# EAGLE schematic NEOPUUTA (EAGLE 9.6.2)
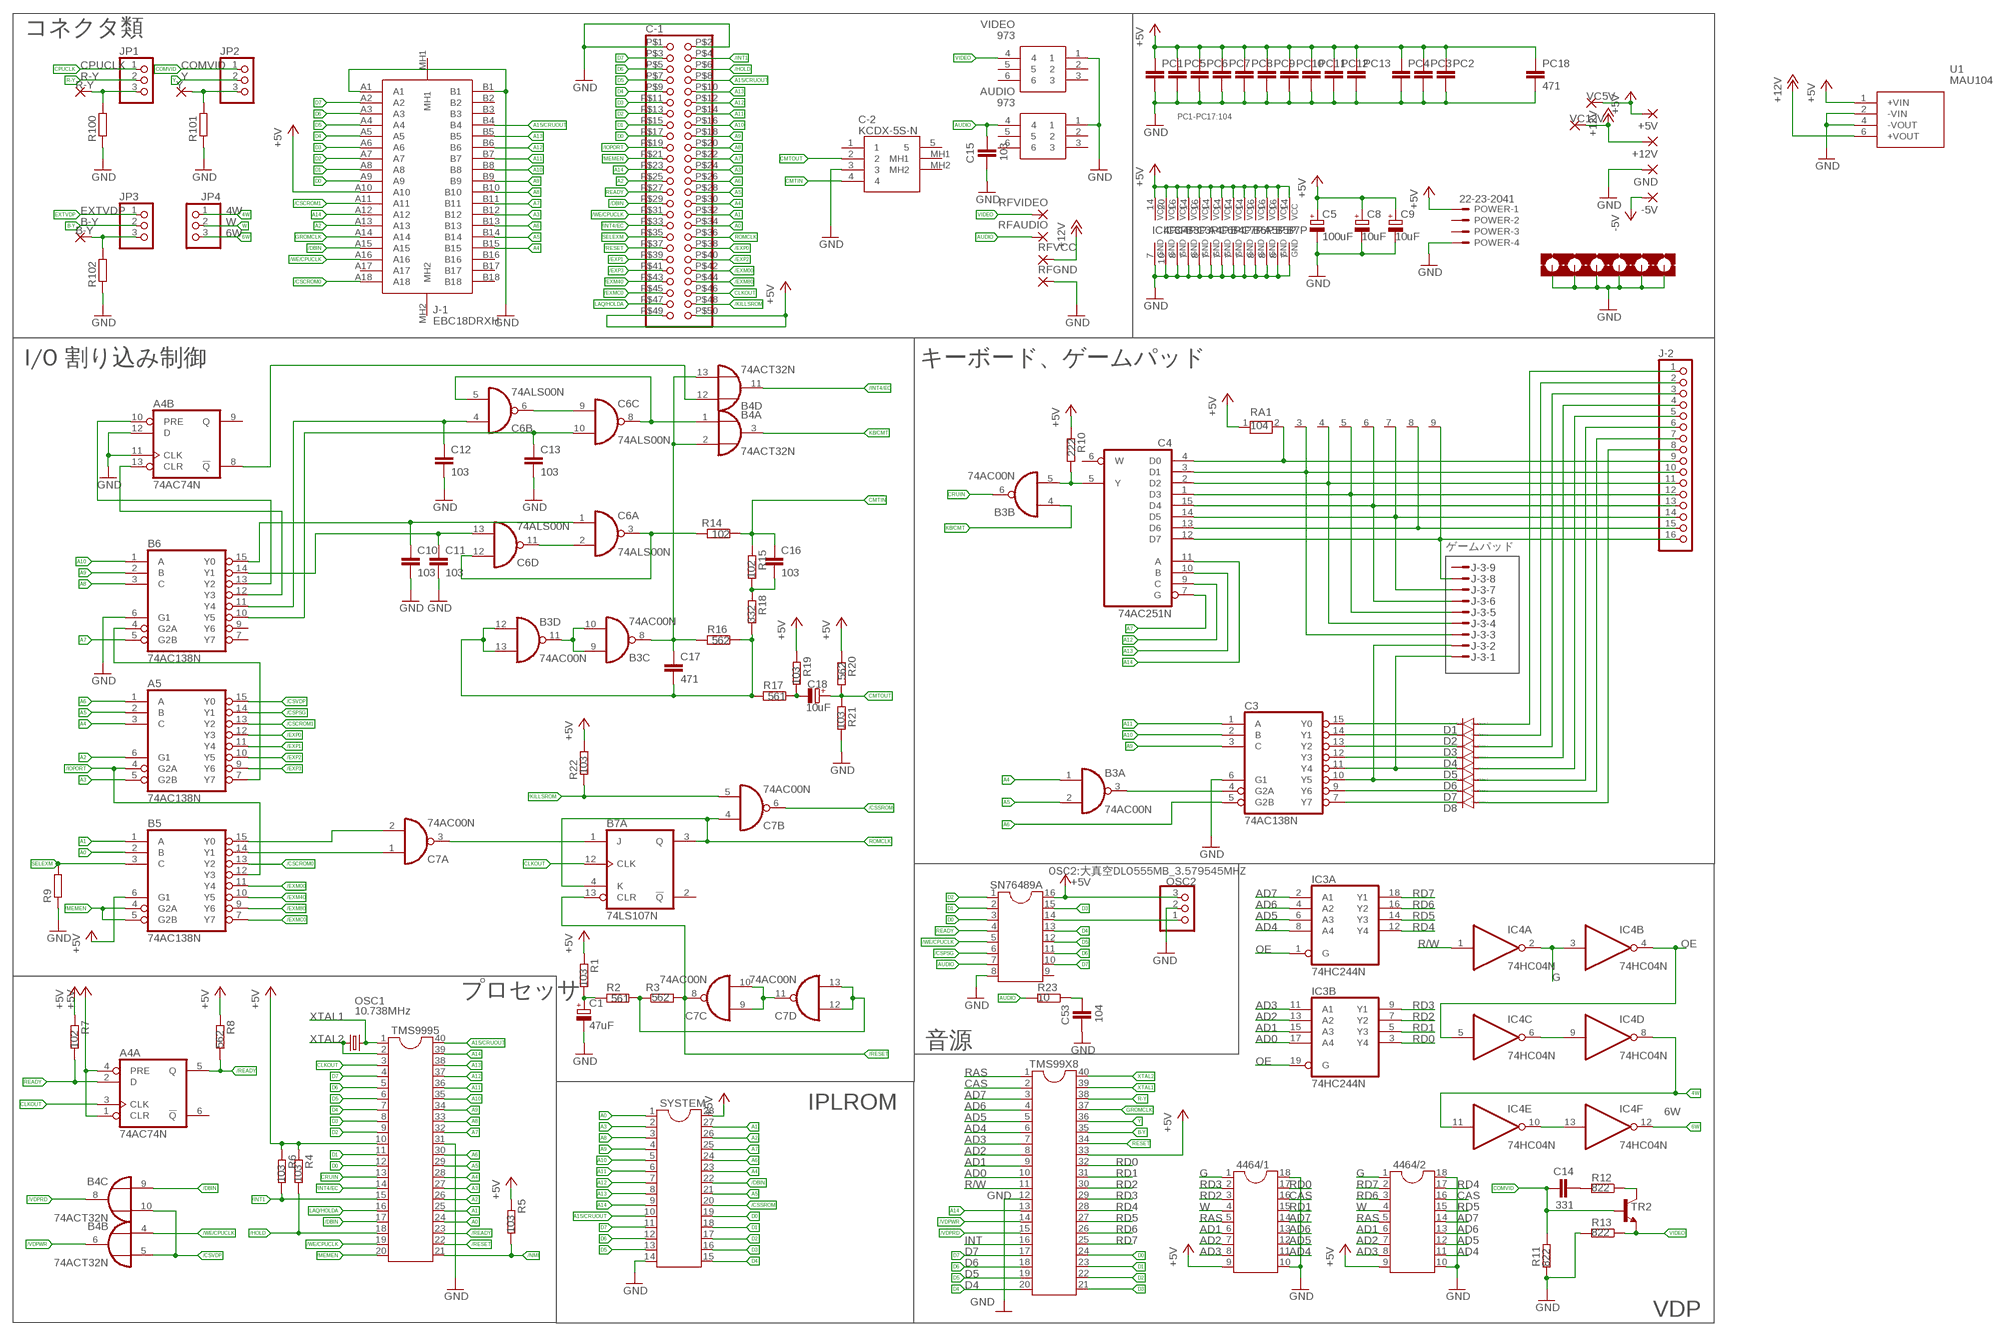
[diagram p0: schematic, sheet 1]

## Parts
4464/1  DIL18  [DIL18]
4464/2  DIL18  [DIL18]
+5V  3,81/1,4  [3,81/1,4]
+12V  3,81/1,4  [3,81/1,4]
-5V  3,81/1,4  [3,81/1,4]
A4  74AC74N  [DIL14]
A5  74AC138N  [DIL16]
AUDIO  973  [973_1]
B3  74AC00N  [DIL14]
B4  74ACT32N  [DIL14]
B5  74AC138N  [DIL16]
B6  74AC138N  [DIL16]
B7  74LS107N  [DIL14]
B-Y  1,6/0,9  [1,6/0,9]
C1  47uF  CPOL-EUE1.8-4  [E1,8-4]
C3  74AC138N  [DIL16]
C4  74AC251N  [DIL16]
C5  100uF  CPOL-EUE2.5-7  [E2,5-7]
C6  74ALS00N  [DIL14]
C7  74AC00N  [DIL14]
C8  10uF  CPOL-EUE1.8-4  [E1,8-4]
C9  10uF  CPOL-EUE1.8-4  [E1,8-4]
C10  103  C-EU050-025X075  [C050-025X075]
C11  103  C-EU050-025X075  [C050-025X075]
C12  103  C-EU050-025X075  [C050-025X075]
C13  103  C-EU050-025X075  [C050-025X075]
C14  331  C-EU050-025X075  [C050-025X075]
C15  103  C-EU050-025X075  [C050-025X075]
C16  103  C-EU050-025X075  [C050-025X075]
C17  471  C-EU050-025X075  [C050-025X075]
C18  10uF  CPOL-EUE1.8-4  [E1,8-4]
C53  104  C-EU050-025X075  [C050-025X075]
C-1  50PI_CARDEDGE_2.54MM_MOTHER  [50PIN_CARDEDGE_2.54MM]
C-2  KCDX-5S-N  [KCDX5SN]
D1  1N4148DO35-10  [DO35-10]
D2  1N4148DO35-10  [DO35-10]
D3  1N4148DO35-10  [DO35-10]
D4  1N4148DO35-10  [DO35-10]
D5  1N4148DO35-10  [DO35-10]
D6  1N4148DO35-10  [DO35-10]
D7  1N4148DO35-10  [DO35-10]
D8  1N4148DO35-10  [DO35-10]
GND  3,81/1,4  [3,81/1,4]
H1  MOUNT-PAD-SQUARE3.2  [3,2-PAD-SQUARE]
H2  MOUNT-PAD-SQUARE3.2  [3,2-PAD-SQUARE]
H3  MOUNT-PAD-SQUARE3.2  [3,2-PAD-SQUARE]
H4  MOUNT-PAD-SQUARE3.2  [3,2-PAD-SQUARE]
H5  MOUNT-PAD-SQUARE3.2  [3,2-PAD-SQUARE]
H6  MOUNT-PAD-SQUARE3.2  [3,2-PAD-SQUARE]
IC3  74HC244N  [DIL20]
IC4  74HC04N  [DIL14]
J-1  EBC18DRXH  [EBC18DRXH]
J-2  PINHD-1X16  [1X16]
J-3  M09HPS  [M09HP]
JP1  PINHD-1X3  [1X03]
JP2  PINHD-1X3  [1X03]
JP3  PINHD-1X3  [1X03]
JP4  PINHD-1X3  [1X03]
OSC1  10.738MHz  CRYSTALHC49S  [HC49/S]
OSC2  PINHD-1X3  [1X03]
PC1  C-EU050-025X075  [C050-025X075]
PC2  C-EU050-025X075  [C050-025X075]
PC3  C-EU050-025X075  [C050-025X075]
PC4  C-EU050-025X075  [C050-025X075]
PC5  C-EU050-025X075  [C050-025X075]
PC6  C-EU050-025X075  [C050-025X075]
PC7  C-EU050-025X075  [C050-025X075]
PC8  C-EU050-025X075  [C050-025X075]
PC9  C-EU050-025X075  [C050-025X075]
PC10  C-EU050-025X075  [C050-025X075]
PC11  C-EU050-025X075  [C050-025X075]
PC12  C-EU050-025X075  [C050-025X075]
PC13  C-EU050-025X075  [C050-025X075]
PC18  471  C-EU050-025X075  [C050-025X075]
POWER  22-23-2041  [22-23-2041]
R1  103  R-EU_0207/10  [0207/10]
R2  561  R-EU_0207/10  [0207/10]
R3  562  R-EU_0207/10  [0207/10]
R4  103  R-EU_0207/10  [0207/10]
R5  103  R-EU_0207/10  [0207/10]
R6  103  R-EU_0207/10  [0207/10]
R7  102  R-EU_0207/10  [0207/10]
R8  562  R-EU_0207/10  [0207/10]
R9  R-EU_0207/10  [0207/10]
R10  222  R-EU_0207/10  [0207/10]
R11  822  R-EU_0207/10  [0207/10]
R12  822  R-EU_0207/10  [0207/10]
R13  822  R-EU_0207/10  [0207/10]
R14  102  R-EU_0207/10  [0207/10]
R15  102  R-EU_0207/10  [0207/10]
R16  562  R-EU_0207/10  [0207/10]
R17  561  R-EU_0207/10  [0207/10]
R18  332  R-EU_0207/10  [0207/10]
R19  103  R-EU_0207/10  [0207/10]
R20  562  R-EU_0207/10  [0207/10]
R21  103  R-EU_0207/10  [0207/10]
R22  103  R-EU_0207/10  [0207/10]
R23  10  R-EU_0207/10  [0207/10]
R100  R-EU_0207/10  [0207/10]
R101  R-EU_0207/10  [0207/10]
R102  R-EU_0207/10  [0207/10]
R-Y  1,6/0,9  [1,6/0,9]
RA1  104  RN08  [RN-9]
RFAUDIO  3,81/1,4  [3,81/1,4]
RFGND  3,81/1,4  [3,81/1,4]
RFVCC  3,81/1,4  [3,81/1,4]
RFVIDEO  3,81/1,4  [3,81/1,4]
SN76489A  DIL16  [DIL16]
SYSTEM  DIL28  [DIL28-6]
TMS99X8  DIL40  [DIL40]
TMS9995  DIL40  [DIL40]
TR2  -NPN-TO92-ECB  [TO92-ECB]
U1  MAU104  [MAU104]
VC5V  1,6/0,9  [1,6/0,9]
VC12V  1,6/0,9  [1,6/0,9]
VIDEO  973  [973_1]
Y  1,6/0,9  [1,6/0,9]

## Nets
4W: IC4.8(D:O) IC4.11(E:I) JP4.1
6W: IC4.12(F:O) JP4.3
+5V: 4464/1.9 4464/2.9 +5V.1(P) A4.1(A:CLR) A4.4(A:PRE) A4.14(P:VCC) A5.16(VCC) B3.14(P:VCC) B4.14(P:VCC) B5.6(G1) B5.16(VCC) B6.16(VCC) B7.14(P:VCC) C3.16(VCC) C4.16(VCC) C5.+ C6.14(P:VCC) C7.14(P:VCC) C8.+ C9.+ C-1.P$49 C-1.P$50 IC3.20(P:VCC) IC4.14(P:VCC) J-1.A10 OSC2.3 PC1.1 PC2.1 PC3.1 PC4.1 PC5.1 PC6.1 PC7.1 PC8.1 PC9.1 PC10.1 PC11.1 PC12.1 PC13.1 PC18.1 POWER.1 R1.2 R4.2 R5.2 R6.2 R7.2 R8.2 R10.1 R19.2 R20.1 R22.2 RA1.1 SN76489A.16 SYSTEM.28 TMS99X8.33 TMS9995.10 U1.1(+VIN) VC5V.1(P)
+12V: +12V.1(P) RFVCC.1(P) U1.6(+VOUT) VC12V.1(P)
-5V: -5V.1(P)
/CSCROM0: B5.13(Y2) J-1.A18
/CSCROM1: A5.13(Y2) J-1.A11
/CSPSG: A5.14(Y1) SN76489A.6
/CSSROM: C7.6(B:O) SYSTEM.20
/CSVDP: A5.15(Y0) B4.5(B:I1) B4.10(C:I1)
/DBIN: B4.9(C:I0) C-1.P$29 J-1.A15 SYSTEM.22 TMS9995.17
/EXM00: B5.11(Y4) C-1.P$42
/EXM40: B5.10(Y5) C-1.P$43
/EXM80: B5.9(Y6) C-1.P$44
/EXMC0: B5.7(Y7) C-1.P$45
/EXP0: A5.12(Y3) C-1.P$38
/EXP1: A5.11(Y4) C-1.P$39
/EXP2: A5.10(Y5) C-1.P$40
/EXP3: A5.9(Y6) C-1.P$41
/HOLD: C-1.P$6 R4.1 TMS9995.18
/INT1: C-1.P$4 R6.1 TMS9995.15
/INT4/EC: B4.11(D:O) C-1.P$33 TMS9995.14
/IOPORT: A5.4(G2A) B5.12(Y3) C-1.P$19
/KILLSROM: C7.5(B:I1) C-1.P$48 R22.1
/MEMEN: B5.4(G2A) B5.5(G2B) C-1.P$21 TMS9995.20
/NMI: R5.1 TMS9995.21
/READY: A4.5(A:Q) R8.1 TMS9995.23
/RESET: B7.13(A:CLR) C7.8(C:O) C-1.P$37 R3.2 TMS9995.22
/VDPRD: B4.8(C:O) TMS99X8.15
/VDPWR: B4.6(B:O) TMS99X8.14
/WE/CPUCLK: B4.4(B:I0) C-1.P$31 J-1.A16 SN76489A.5 TMS9995.19
A0: B5.2(B) C-1.P$34 SYSTEM.1 TMS9995.24
A1: B5.1(A) C-1.P$32 SYSTEM.27 TMS9995.25
A2: A5.6(G1) C-1.P$25 J-1.A13 SYSTEM.26 TMS9995.26
A3: A5.5(G2B) C-1.P$24 J-1.B12 SYSTEM.2 TMS9995.27
A4: A5.3(C) B3.1(A:I0) C-1.P$30 J-1.B15 SYSTEM.23 TMS9995.28
A5: A5.2(B) B3.2(A:I1) C-1.P$28 J-1.B14 SYSTEM.21 TMS9995.29
A6: A5.1(A) C3.5(G2B) C-1.P$26 J-1.B13 SYSTEM.24 TMS9995.30
A7: B6.5(G2B) C4.7(G) C-1.P$22 J-1.B11 SYSTEM.25 TMS9995.32
A8: B6.3(C) C-1.P$20 J-1.B10 SYSTEM.3 TMS9995.33
A9: B6.2(B) C3.3(C) C-1.P$18 J-1.B9 SYSTEM.4 TMS9995.34
A10: B6.1(A) C3.2(B) C-1.P$16 J-1.B8 SYSTEM.5 TMS9995.35
A11: C3.1(A) C-1.P$14 J-1.B7 SYSTEM.6 TMS9995.36
A12: C4.9(C) C-1.P$12 J-1.B6 SYSTEM.7 TMS9995.37
A13: C4.10(B) C-1.P$10 J-1.B5 SYSTEM.8 TMS9995.38
A14: C4.11(A) C-1.P$23 J-1.A12 SYSTEM.9 TMS99X8.13 TMS9995.39
A15/CRUOUT: C-1.P$8 J-1.B4 SYSTEM.10 TMS9995.40
AD0: IC3.17(B:A4) TMS99X8.10
AD1: 4464/1.6 4464/2.6 IC3.15(B:A3) TMS99X8.9
AD2: 4464/1.7 4464/2.7 IC3.13(B:A2) TMS99X8.8
AD3: 4464/1.8 4464/2.8 IC3.11(B:A1) TMS99X8.7
AD4: 4464/1.11 4464/2.11 IC3.8(A:A4) TMS99X8.6
AD5: 4464/1.12 4464/2.12 IC3.6(A:A3) TMS99X8.5
AD6: 4464/1.13 4464/2.13 IC3.4(A:A2) TMS99X8.4
AD7: 4464/1.14 4464/2.14 IC3.2(A:A1) TMS99X8.3
AUDIO: AUDIO.4 C15.2 R23.2 RFAUDIO.1(P) SN76489A.7
B-Y: JP3.2 TMS99X8.35
CAS: 4464/1.16 4464/2.16 TMS99X8.2
CLKOUT: A4.3(A:CLK) B7.12(A:CLK) C-1.P$46 TMS9995.3
CMTIN: C16.1 C-2.4 R14.1 R15.2
CMTOUT: C18.+ C-2.2 R20.2 R21.2
COMVID: C14.1 JP2.1 R11.1 TR2.B
CPUCLK: JP1.1
CRUIN: B3.6(B:O) TMS9995.13
D0: C-1.P$17 J-1.A9 SN76489A.3 SYSTEM.19 TMS99X8.24 TMS9995.12
D1: C-1.P$15 J-1.A8 SN76489A.2 SYSTEM.18 TMS99X8.23 TMS9995.11
D2: C-1.P$13 J-1.A7 SN76489A.1 SYSTEM.17 TMS99X8.22 TMS9995.9
D3: C-1.P$11 J-1.A6 SN76489A.15 SYSTEM.16 TMS99X8.21 TMS9995.8
D4: C-1.P$9 J-1.A5 SN76489A.13 SYSTEM.15 TMS99X8.20 TMS9995.7
D5: C-1.P$7 J-1.A4 SN76489A.12 SYSTEM.13 TMS99X8.19 TMS9995.6
D6: C-1.P$5 J-1.A3 SN76489A.11 SYSTEM.12 TMS99X8.18 TMS9995.5
D7: C-1.P$3 J-1.A2 SN76489A.10 SYSTEM.11 TMS99X8.17 TMS9995.4
EXTVDP: JP3.1
G: 4464/1.1 4464/2.1 IC4.2(A:O) IC4.3(B:I)
GND: 4464/1.10 4464/1.18 4464/2.10 4464/2.18 A4.7(P:GND) A4.11(B:CLK) A4.12(B:D) A5.8(GND) AUDIO.1 B3.7(P:GND) B4.7(P:GND) B5.8(GND) B6.6(G1) B6.8(GND) B7.7(P:GND) C1.- C3.6(G1) C3.8(GND) C4.8(GND) C5.- C6.7(P:GND) C7.7(P:GND) C8.- C9.- C10.2 C11.2 C12.2 C13.2 C15.1 C53.1 C-1.P$1 C-1.P$2 C-2.3 GND.1(P) H1.B3,2(MOUNT) H2.B3,2(MOUNT) H3.B3,2(MOUNT) H4.B3,2(MOUNT) H5.B3,2(MOUNT) H6.B3,2(MOUNT) IC3.10(P:GND) IC4.7(P:GND) J-1.A1 J-1.B1 OSC2.2 PC1.2 PC2.2 PC3.2 PC4.2 PC5.2 PC6.2 PC7.2 PC8.2 PC9.2 PC10.2 PC11.2 PC12.2 PC13.2 PC18.2 POWER.4 R9.1 R11.2 R13.2 R21.1 R100.1 R101.1 R102.1 RFGND.1(P) SN76489A.8 SYSTEM.14 TMS99X8.12 TMS9995.31 U1.2(-VIN) U1.4(-VOUT) VIDEO.1
GROMCLK: J-1.A14 TMS99X8.37
INT: TMS99X8.16
KB/CMT: B3.4(B:I0) B4.3(A:O)
LAQ/HOLDA: C-1.P$47 TMS9995.16
N$1: A5.7(Y7) B6.4(G2A)
N$2: A4.10(B:PRE) B6.13(Y2)
N$3: C6.6(B:O) C6.9(C:I0)
N$4: A4.13(B:CLR) B6.12(Y3)
N$5: B4.1(A:I0) C6.5(B:I1) C6.8(C:O)
N$6: B6.11(Y4) C6.4(B:I0) C12.1
N$7: B6.10(Y5) C6.10(C:I1) C13.1
N$8: C6.2(A:I1) C6.11(D:O)
N$9: B3.8(C:O) B4.2(A:I1) B4.13(D:I1) C17.1 R16.2
N$10: B6.14(Y1) C6.13(D:I1) C11.1
N$11: B6.15(Y0) C6.1(A:I0) C10.1
N$12: B3.9(C:I0) B3.10(C:I1) B3.11(D:O)
N$13: B3.12(D:I0) B3.13(D:I1) C17.2 R16.1 R17.2 R18.1
N$14: C6.3(A:O) C6.12(D:I0) R14.2
N$15: A4.8(B:!Q) B4.12(D:I0)
N$16: C16.2 R15.1 R18.2
N$17: C7.9(C:I0) C7.10(C:I1) C7.11(D:O)
N$18: C18.- R17.1 R19.1
N$19: B5.14(Y1) C7.1(A:I0)
N$20: B5.15(Y0) C7.2(A:I1)
N$21: B7.1(A:J) C7.3(A:O)
N$22: B3.5(B:I1) C4.5(Y) R10.2
N$23: C1.+ R1.1 R2.2
N$24: C4.4(D0) J-2.9 RA1.2
N$25: C4.3(D1) J-2.10 J-3.3 RA1.3
N$26: C4.2(D2) J-2.11 J-3.4 RA1.4
N$27: C7.12(D:I0) C7.13(D:I1) R2.1 R3.1
N$28: C4.1(D3) J-2.12 J-3.5 RA1.5
N$29: C4.15(D4) J-2.13 J-3.6 RA1.6
N$30: C4.14(D5) J-2.14 J-3.7 RA1.7
N$31: C4.13(D6) J-2.15 RA1.8
N$32: C4.12(D7) J-2.16 J-3.8 RA1.9
N$33: B3.3(A:O) C3.4(G2A)
N$34: C3.15(Y0) D1.C
N$35: C3.14(Y1) D2.C
N$36: C3.13(Y2) D3.C
N$37: C3.12(Y3) D4.C
N$38: C3.9(Y6) D7.C
N$39: C3.7(Y7) D8.C
N$40: C3.11(Y4) D5.C J-3.1
N$41: C3.10(Y5) D6.C J-3.2
N$42: D1.A J-2.1
N$43: D2.A J-2.2
N$44: D3.A J-2.3
N$45: D4.A J-2.4
N$46: D5.A J-2.5
N$47: D6.A J-2.6
N$48: D7.A J-2.7
N$49: D8.A J-2.8
N$51: JP1.3 R100.2 R-Y.1(P)
N$52: B-Y.1(P) JP3.3 R102.2
N$53: JP2.3 R101.2 Y.1(P)
N$54: IC4.6(C:O) IC4.9(D:I)
N$55: IC4.10(E:O) IC4.13(F:I)
N$56: C14.2 R12.2
N$57: R12.1 TR2.C
N$58: C53.2 R23.1
N$60: OSC2.1 SN76489A.14
OE: IC3.1(A:G) IC3.19(B:G) IC4.4(B:O) IC4.5(C:I)
R-Y: JP1.2 TMS99X8.38
R/W: IC4.1(A:I) TMS99X8.11
RAS: 4464/1.5 4464/2.5 TMS99X8.1
RD0: 4464/1.17 IC3.3(B:Y4) TMS99X8.32
RD1: 4464/1.15 IC3.5(B:Y3) TMS99X8.31
RD2: 4464/1.3 IC3.7(B:Y2) TMS99X8.30
RD3: 4464/1.2 IC3.9(B:Y1) TMS99X8.29
RD4: 4464/2.17 IC3.12(A:Y4) TMS99X8.28
RD5: 4464/2.15 IC3.14(A:Y3) TMS99X8.27
RD6: 4464/2.3 IC3.16(A:Y2) TMS99X8.26
RD7: 4464/2.2 IC3.18(A:Y1) TMS99X8.25
READY: A4.2(A:D) C-1.P$27 R7.1 SN76489A.4
RESET: TMS99X8.34
ROMCLK: B7.3(A:Q) B7.4(A:K) C7.4(B:I0) C-1.P$36
SELEXM: B5.3(C) C-1.P$35 R9.2
VIDEO: R13.1 RFVIDEO.1(P) TR2.E VIDEO.4
W: 4464/1.4 4464/2.4 JP4.2
XTAL1: OSC1.2 TMS99X8.39 TMS9995.1
XTAL2: OSC1.1 TMS99X8.40 TMS9995.2
Y: JP2.2 TMS99X8.36
Unconnected: A4.6(A:!Q) A4.9(B:Q) AUDIO.2 AUDIO.3 AUDIO.5 AUDIO.6 B6.7(Y7) B6.9(Y6) B7.2(A:!Q) B7.5(B:Q) B7.6(B:!Q) B7.8(B:J) B7.9(B:CLK) B7.10(B:CLR) B7.11(B:K) C4.6(W) C-2.1 C-2.5 C-2.MH1 C-2.MH2 J-1.A17 J-1.B2 J-1.B3 J-1.B16 J-1.B17 J-1.B18 J-1.MH1 J-1.MH2 J-3.9 POWER.2 POWER.3 SN76489A.9 VIDEO.2 VIDEO.3 VIDEO.5 VIDEO.6

## Notes on the sheet
- コネクタ類
- PC1-PC17:104
- I/O 割り込み制御 | キーボード、ゲームパッド
- ゲームパッド
- OSC2:大真空DLO555MB_3.579545MHZ
- プロセッサ
- 音源
- IPLROM
- VDP

## Library data of the parts
4464/1 4464/2 = ic-package:DIL18: Dual In Line / Socket
+5V +12V -5V GND RFAUDIO RFGND RFVCC RFVIDEO = wirepad:3,81/1,4: THROUGH-HOLE PAD
A4 = 74xx-eu:74*74: Dual D type positive edge triggered FLIP FLOP, preset and clear
A5 B5 B6 C3 = 74xx-eu:74*138: 3-line to 8-line DECODER/DEMULTIPLEXER
AUDIO VIDEO = SamacSys_Parts:973: RCA Phono Connectors RCA PCB JACK YELLOW Source: Datasheet <https://componentsearchengine.com/Datasheets/1/973.pdf>; DESCRIPTION: RCA Phono Connectors RCA PCB JACK YELLOW; HEIGHT: mm; MANUFACTURER_NAME: Keystone Electronics; MANUFACTURER_PART_NUMBER: 973; MOUSER_PART_NUMBER: 534-973; MOUSER_PRICE-STOCK: https://www.mouser.co.uk/ProductDetail/Keystone-Electronics/973?qs=sOYabIlKNmcMm%252BHv8SuOtQ%3D%3D
B3 C6 C7 = 74xx-eu:74*00: Quad 2-input NAND gate
B4 = 74xx-eu:74*32: Quad 2-input OR gate
B7 = 74xx-eu:74*107: Dual J-K FLIP FLOP, clear
B-Y R-Y VC5V VC12V Y = wirepad:1,6/0,9: THROUGH-HOLE PAD
C1 C5 C8 C9 C18 = rcl:CPOL-EU: POLARIZED CAPACITOR, European symbol; SPICEPREFIX: C
C4 = 74xx-eu:74*251: 1 of 8 data SELECTOR/MULTIPLEXER, 3-state
C10-C17 C53 PC1-PC13 PC18 = rcl:C-EU: CAPACITOR, European symbol; SPICEPREFIX: C
C-1 = cardedge connector:50PI_CARDEDGE_2.54MM_MOTHER
C-2 = SamacSys_Parts:KCDX-5S-N: Circular DIN Connectors 5P R/A PCB NON SHLD 10mm CIRC DIN RECPT Source: Datasheet <http://www.kycon.com/Pub_Eng_Draw/KCDX-5S-N.pdf>; DESCRIPTION: Circular DIN Connectors 5P R/A PCB NON SHLD 10mm CIRC DIN RECPT; HEIGHT: 19.5mm; MANUFACTURER_NAME: Kycon; MANUFACTURER_PART_NUMBER: KCDX-5S-N; MOUSER_PART_NUMBER: 806-KCDX-5S-N; MOUSER_PRICE-STOCK: https://www.mouser.co.uk/ProductDetail/Kycon/KCDX-5S-N?qs=uMQTibCNu0QKDGeRAj6hLg%3D%3D
D1-D8 = diode:1N4148: DIODE high speed (Philips)
H1-H6 = holes:MOUNT-PAD-SQUARE: MOUNTING PAD, square
IC3 = 74xx-eu:74*244: Octal BUFFER and LINE DRIVER, 3-state
IC4 = 74xx-eu:74*04: Hex INVERTER
J-1 = SamacSys_Parts:EBC18DRXH: CONN EDGE DUAL FMALE 36POS 0.100 Source: Datasheet <https://drawings-pdf.s3.amazonaws.com/C10881.pdf>; DESCRIPTION: CONN EDGE DUAL FMALE 36POS 0.100; HEIGHT: 11.45mm; MANUFACTURER_NAME: Sullins; MANUFACTURER_PART_NUMBER: EBC18DRXH
J-2 = pinheadMOD:PINHD-1X16: PIN HEADER
J-3 = con-subd:M09?S: SUB-D; OC_FARNELL: unknown; OC_NEWARK: unknown
JP1-JP4 OSC2 = pinheadMOD:PINHD-1X3: PIN HEADER
OSC1 = crystal:CRYSTAL: CRYSTAL; OC_FARNELL: 1667008; OC_NEWARK: unknown
POWER = con-molex:22-23-2041: .100" (2.54mm) Center Header - 4 Pin; MF: MOLEX; MPN: 22-23-2041; OC_FARNELL: 1462920; OC_NEWARK: 38C0355
R1-R23 R100-R102 = rcl:R-EU_: RESISTOR, European symbol; SPICEPREFIX: R
RA1 = resistor-net:RN08: RESISTOR NETWORK; OC_FARNELL: unknown; OC_NEWARK: unknown
SN76489A = ic-package:DIL16: Dual In Line / Socket
SYSTEM = ic-package:DIL28: Dual In Line
TMS99X8 TMS9995 = ic-package:DIL40: Dual In Line
TR2 = transistor:*-NPN-: NPN Transistror BF959 corrected 2008.03.06
U1 = SamacSys_Parts:MAU104: DC-DC CONVERTER 1W, SIP-Package Source: Datasheet <https://www.minmaxpower.com/storage/media/Product-MINMAX/MAU100/Document/MAU100_Datasheet.pdf>; DESCRIPTION: DC-DC CONVERTER 1W, SIP-Package; HEIGHT: 10.45mm; MANUFACTURER_NAME: Minmax; MANUFACTURER_PART_NUMBER: MAU104